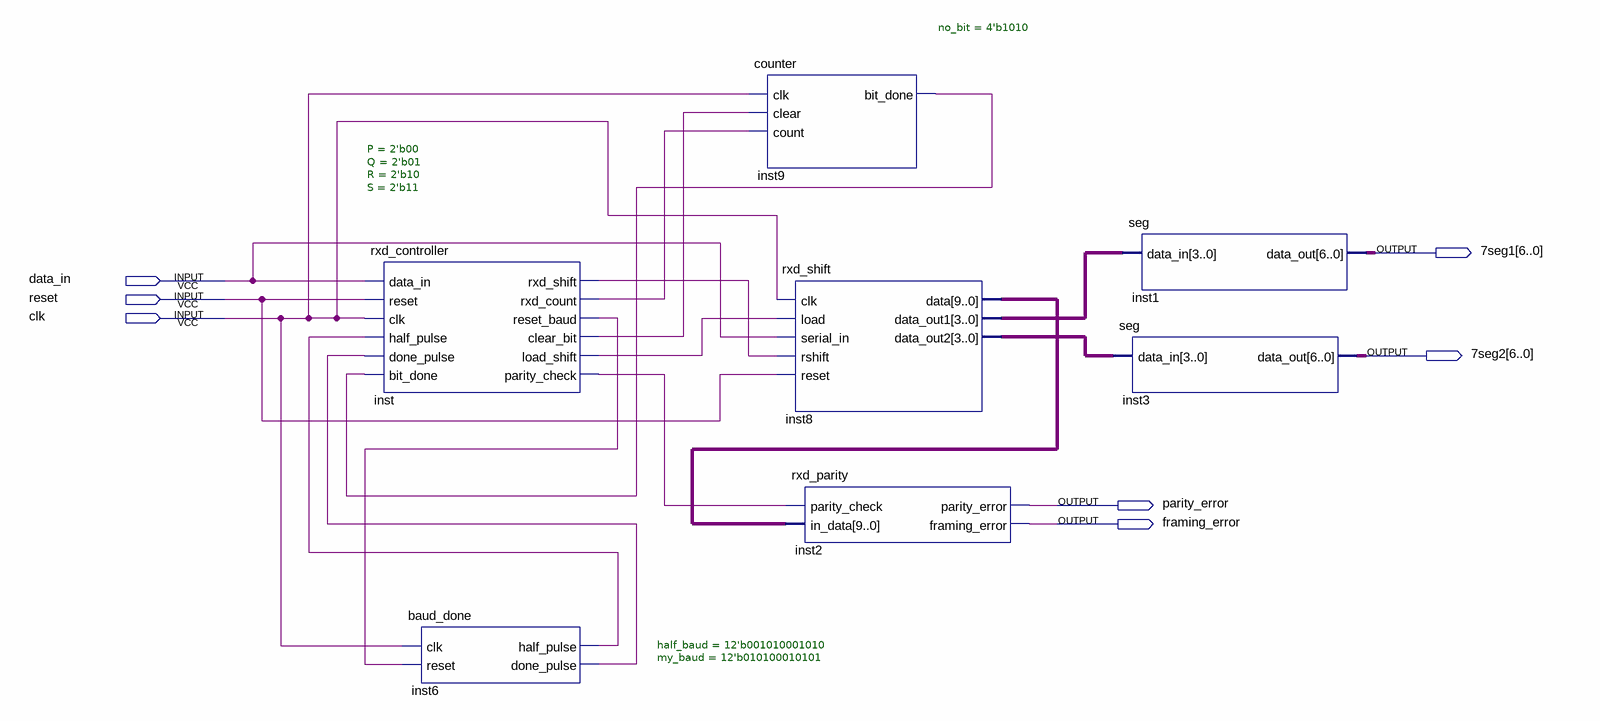
[diagram p0: schematic sheet]
// Quartus schematic receiver.bdf as structural Verilog: 7 symbols, 7 pins
module receiver (
  input  data_in,
  input  reset,
  input  clk,
  output [6:0] \7seg1 ,
  output [6:0] \7seg2 ,
  output parity_error,
  output framing_error
);

  wire inst6_done_pulse, inst6_half_pulse, inst9_bit_done, inst_clear_bit, inst_load_shift,
       inst_parity_check, inst_reset_baud, inst_rxd_count, inst_rxd_shift;
  wire [3:0] inst8_data_out1, inst8_data_out2;
  wire [9:0] inst8_data;

  rxd_controller #(.P(2'b00), .Q(2'b01), .R(2'b10), .S(2'b11)) inst (
    .data_in(data_in), .reset(reset), .clk(clk), .half_pulse(inst6_half_pulse),
    .done_pulse(inst6_done_pulse), .bit_done(inst9_bit_done), .rxd_shift(inst_rxd_shift),
    .rxd_count(inst_rxd_count), .reset_baud(inst_reset_baud), .clear_bit(inst_clear_bit),
    .load_shift(inst_load_shift), .parity_check(inst_parity_check));
  baud_done #(.half_baud(12'b001010001010), .my_baud(12'b010100010101)) inst6 (
    .clk(clk), .reset(inst_reset_baud), .half_pulse(inst6_half_pulse), .done_pulse(inst6_done_pulse));
  counter #(.no_bit(4'b1010)) inst9 (
    .clk(clk), .clear(inst_clear_bit), .count(inst_rxd_count), .bit_done(inst9_bit_done));
  rxd_shift inst8 (
    .clk(clk), .load(inst_load_shift), .serial_in(data_in), .rshift(inst_rxd_shift), .reset(reset),
    .data(inst8_data), .data_out1(inst8_data_out1), .data_out2(inst8_data_out2));
  rxd_parity inst2 (
    .parity_check(inst_parity_check), .in_data(inst8_data), .parity_error(parity_error),
    .framing_error(framing_error));
  seg inst3 (.data_in(inst8_data_out2), .data_out(\7seg2 ));
  seg inst1 (.data_in(inst8_data_out1), .data_out(\7seg1 ));
endmodule
